# EAGLE design hb41 (EAGLE 9.6.2)
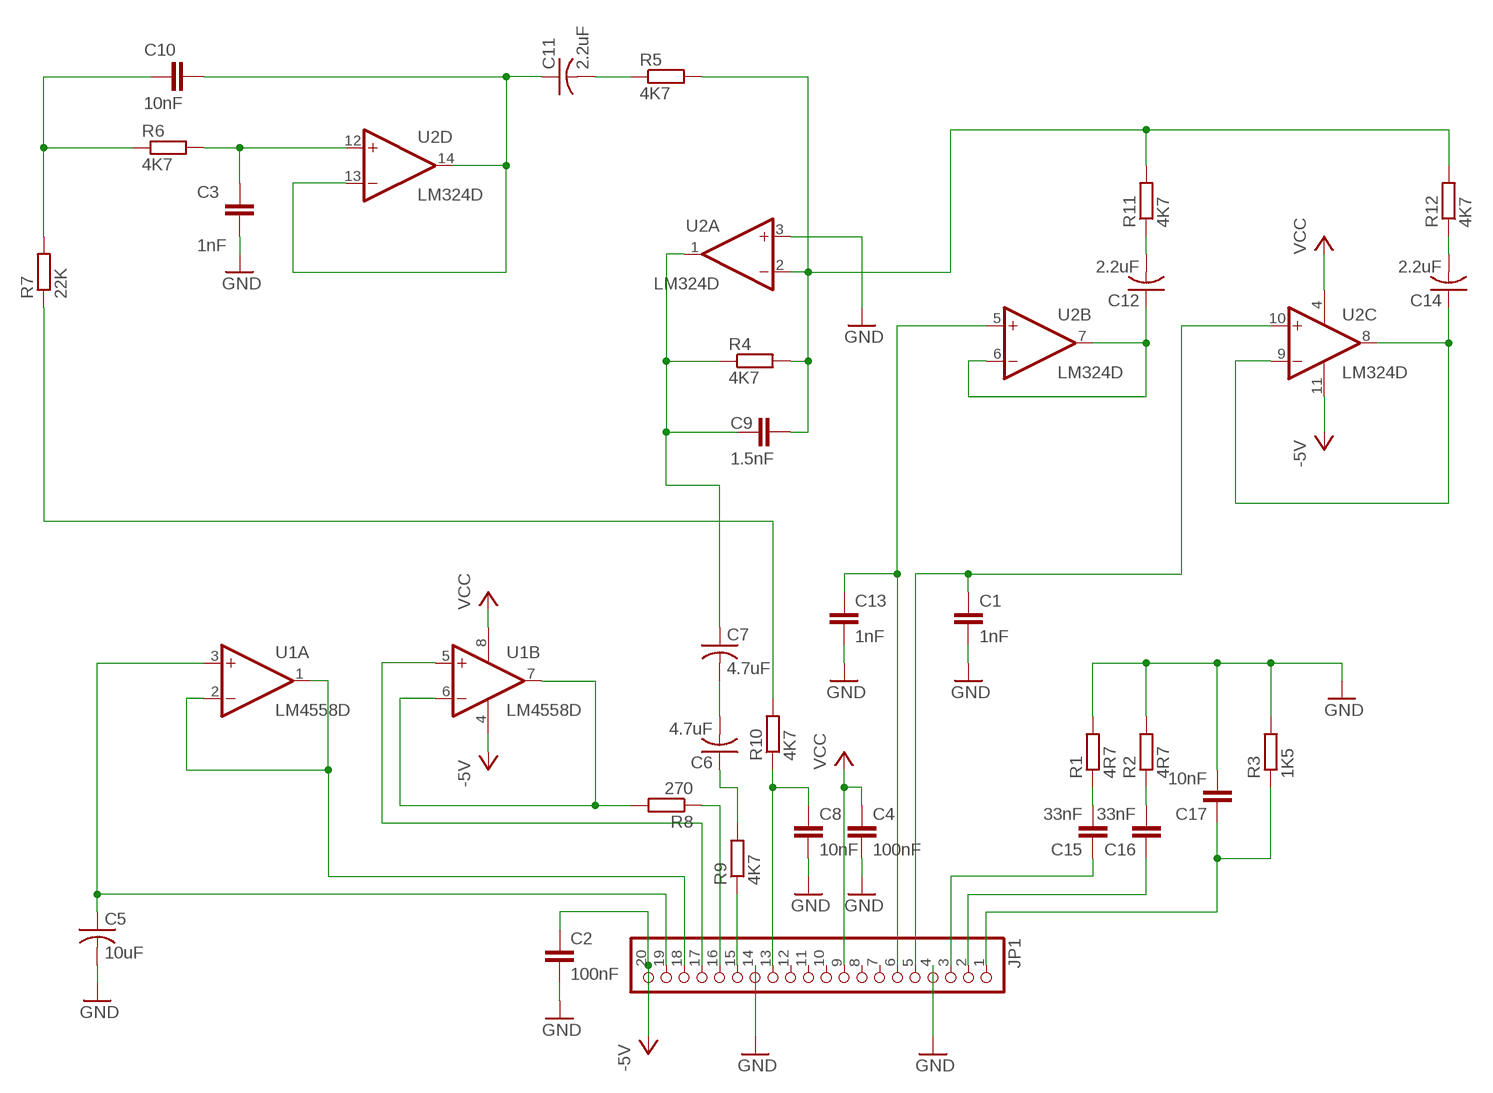
[diagram p0: schematic, sheet 1]

## Parts
C1  1nF  C-EUC0805K  [C0805K]
C2  100nF  C-EUC0805K  [C0805K]
C3  1nF  C-EUC0603  [C0603]
C4  100nF  C-EUC0603  [C0603]
C5  10uF  C-USC1206K  [C1206K]
C6  4.7uF  C-USC1206K  [C1206K]
C7  4.7uF  C-USC1206K  [C1206K]
C8  10nF  C-EUC0603  [C0603]
C9  1.5nF  C-EUC0805K  [C0805K]
C10  10nF  C-EUC0805K  [C0805K]
C11  2.2uF  C-USC1206K  [C1206K]
C12  2.2uF  C-USC1206K  [C1206K]
C13  1nF  C-EUC0805K  [C0805K]
C14  2.2uF  C-USC1206K  [C1206K]
C15  33nF  C-EUC0603  [C0603]
C16  33nF  C-EUC0603  [C0603]
C17  10nF  C-EUC0603  [C0603]
JP1  PINHD-1X20-BIG  [1X20-BIG]
R1  4R7  R-EU_R0603  [R0603]
R2  4R7  R-EU_R0603  [R0603]
R3  1K5  R-EU_R0603  [R0603]
R4  4K7  R-EU_R0603  [R0603]
R5  4K7  R-EU_R0603  [R0603]
R6  4K7  R-EU_R0603  [R0603]
R7  22K  R-EU_R0603  [R0603]
R8  270  R-EU_R0603  [R0603]
R9  4K7  R-EU_R0603  [R0603]
R10  4K7  R-EU_R0603  [R0603]
R11  4K7  R-EU_R0603  [R0603]
R12  4K7  R-EU_R0603  [R0603]
U1  LM4558D  [SO08]
U2  LM324D  [SO14]

## Nets
-5V: C2.1 JP1.20 U1.4(P:V-) U2.11(P:V-)
GND: C1.2 C2.2 C3.1 C4.2 C5.2 C8.2 C13.2 C17.2 JP1.4 JP1.14 R1.2 R2.2 R3.2 U2.3(A:+IN)
N$1: C1.1 JP1.5 U2.10(C:+IN)
N$2: C14.1 U2.8(C:OUT) U2.9(C:-IN)
N$3: C12.1 U2.6(B:-IN) U2.7(B:OUT)
N$4: C13.1 JP1.6 U2.5(B:+IN)
N$5: C15.2 R1.1
N$6: C16.2 R2.1
N$7: C17.1 JP1.1 R3.1
N$8: C12.2 R11.1
N$9: C16.1 JP1.2
N$10: C15.1 JP1.3
N$11: C14.2 R12.1
N$12: C8.1 JP1.13 R10.1
N$13: C9.2 R4.2 R5.2 R11.2 R12.2 U2.2(A:-IN)
N$14: R7.1 R10.2
N$15: C10.1 R6.1 R7.2
N$16: C3.2 R6.2 U2.12(D:+IN)
N$17: C10.2 C11.1 U2.13(D:-IN) U2.14(D:OUT)
N$18: C7.1 C9.1 R4.1 U2.1(A:OUT)
N$19: C11.2 R5.1
N$20: C6.2 C7.2
N$21: C6.1 R9.2
N$22: JP1.15 R9.1
N$23: JP1.16 R8.1
N$24: R8.2 U1.6(B:-IN) U1.7(B:OUT)
N$26: JP1.17 U1.5(B:+IN)
N$27: C5.1 JP1.19 U1.3(A:+IN)
N$28: JP1.18 U1.1(A:OUT) U1.2(A:-IN)
VCC: C4.1 JP1.9 U1.8(P:V+) U2.4(P:V+)
Unconnected: JP1.7 JP1.8 JP1.10 JP1.11 JP1.12

## Library data of the parts
C1-C4 C8-C10 C13 C15-C17 = rcl:C-EU: CAPACITOR, European symbol; SPICEPREFIX: C
C5-C7 C11 C12 C14 = rcl:C-US: CAPACITOR, American symbol; SPICEPREFIX: C
JP1 = adafruit:PINHD-1X20: PIN HEADER
R1-R12 = rcl:R-EU_: RESISTOR, European symbol; SPICEPREFIX: R
U1 = linear:*4558: OP AMP
U2 = linear:LM324: OP AMP

## Board
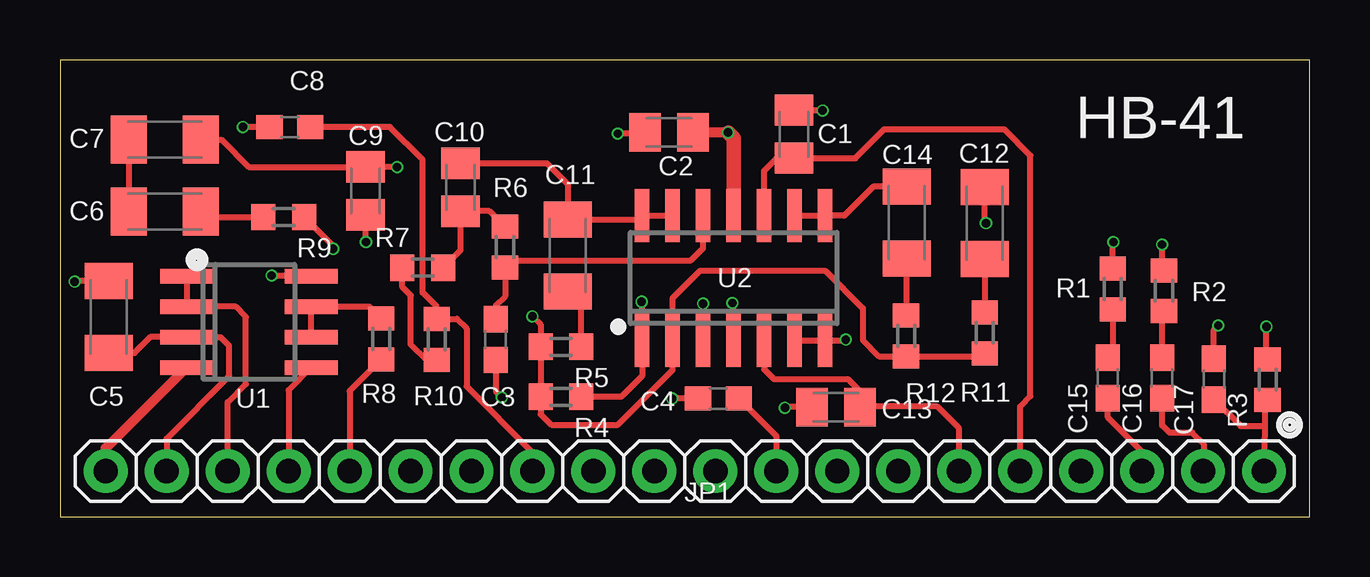
[diagram p1: board, top side]
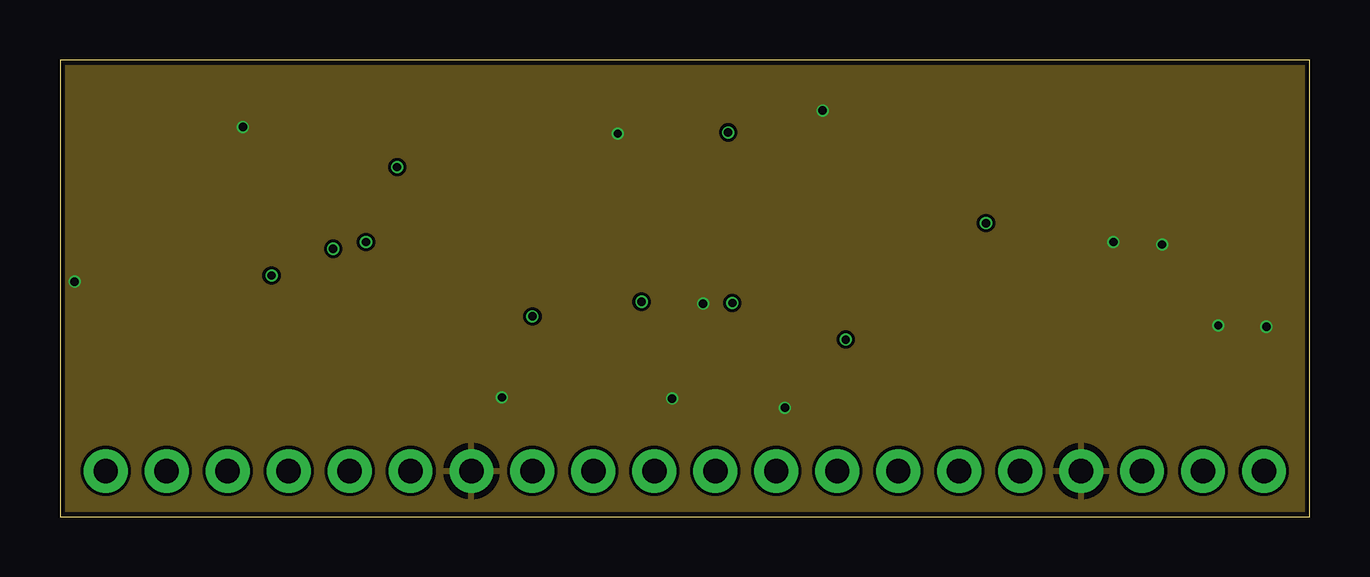
[diagram p2: board, inner layer GND]
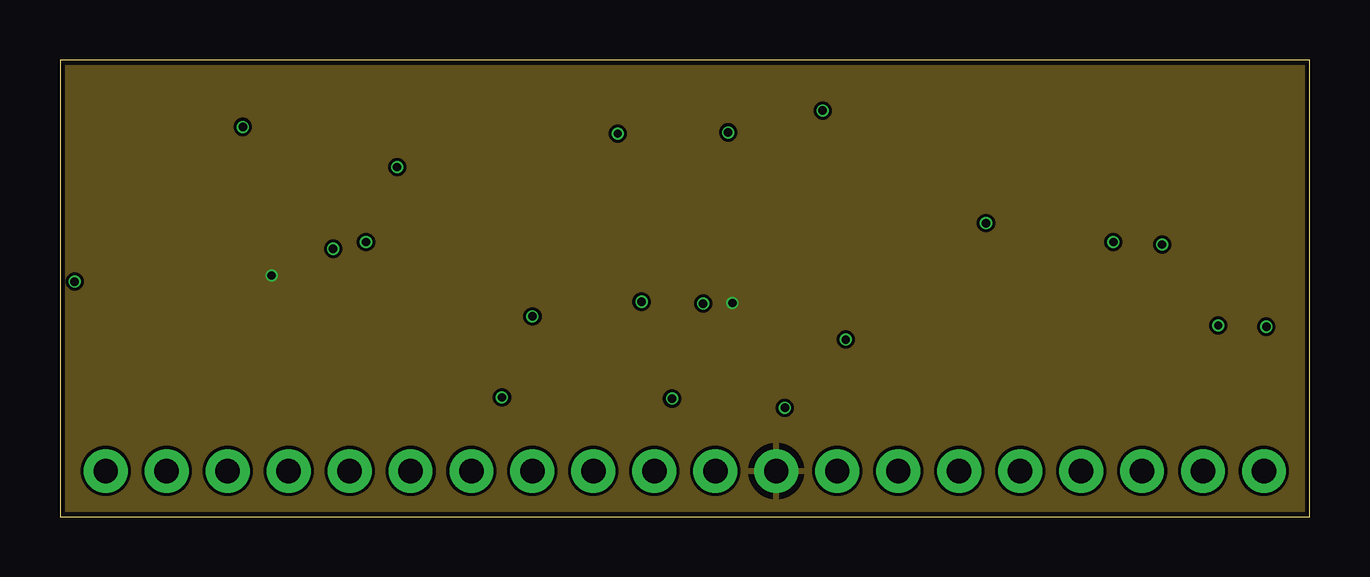
[diagram p3: board, inner layer PWR]
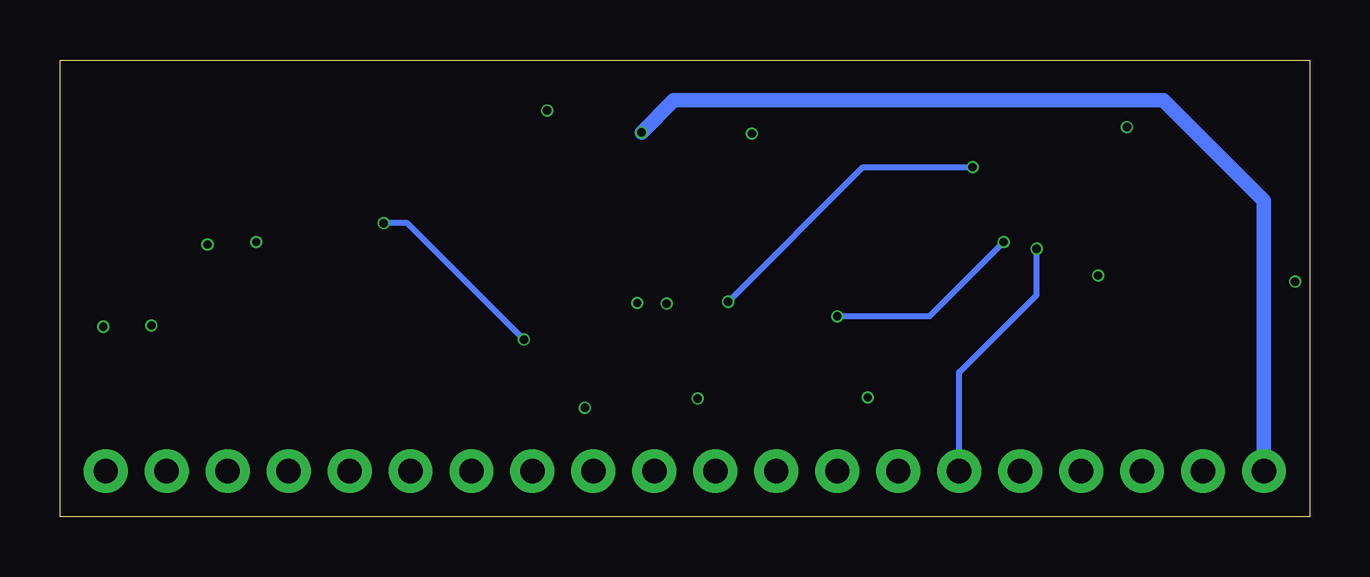
[diagram p4: board, bottom side, seen from below]

Size 52.07 x 19.05 mm. Coordinates in mm from the lower left corner, seen from the top.
Outline: 0,0 52.07,0 52.07,19.05 0,19.05 0,0
Copper layers (1*2*15*16): Top 0.035mm / dielectric 1.6mm / GND 0.035mm / dielectric 0.15mm / PWR 0.035mm / dielectric 0.2mm / Bottom 0.035mm
Design rules "jlcpcb-2layers *": minimum track width 5mil, minimum drill 0.3mm, track to track 5mil, track to pad 5mil, pad to pad 5mil, via to via 5mil, smd to smd 5mil, copper to edge 0.2mm, drill to drill 6mil, minimum pad ring 10mil, minimum via ring 3mil, stop-mask expansion 4mil, vias tented up to drill 0mil, thermal gap 10mil

### Footprints (pad centres in the part's own frame; a part is rotated, then mirrored left to right if it is on the bottom)
C0805K = smd 1.3 x 1.6: 1 -1,0; 2 1,0
C0603 = smd 1.1 x 1: 1 -0.85,0; 2 0.85,0
C1206K = smd 1.5 x 2: 1 -1.5,0; 2 1.5,0
1X20-BIG = drill 1.016 pad 1.778: 1 -24.13,0; 2 -21.59,0; 3 -19.05,0; 4 -16.51,0; 5 -13.97,0; 6 -11.43,0; 7 -8.89,0; 8 -6.35,0; 9 -3.81,0; 10 -1.27,0; 11 1.27,0; 12 3.81,0; 13 6.35,0; 14 8.89,0; 15 11.43,0; 16 13.97,0; 17 16.51,0; 18 19.05,0; 19 21.59,0; 20 24.13,0
R0603 = smd 1 x 1.1: 1 -0.85,0; 2 0.85,0
SO08 = smd 0.6 x 2.2: 1 -1.905,-2.6; 2 -0.635,-2.6; 3 0.635,-2.6; 4 1.905,-2.6; 5 1.905,2.6; 6 0.635,2.6; 7 -0.635,2.6; 8 -1.905,2.6
SO14 = smd 0.6 x 2.2: 1 -3.81,-2.6; 2 -2.54,-2.6; 3 -1.27,-2.6; 4 0,-2.6; 5 1.27,-2.6; 6 2.54,-2.6; 7 3.81,-2.6; 8 3.81,2.6; 9 2.54,2.6; 10 1.27,2.6; 11 0,2.6; 12 -1.27,2.6; 13 -2.54,2.6; 14 -3.81,2.6

### Placement (x,y rotation side)
C1  30.58,15.95 90 top
C2  25.37,16.03 180 top
C3  18.16,7.39 90 top
C4  27.43,4.93 180 top
C5  2.03,8.33 90 top
C6  4.37,12.73 180 top
C7  4.37,15.72 180 top
C8  9.58,16.26 180 top
C9  12.73,13.59 270 top
C10  16.69,13.74 90 top
C11  21.16,10.9 270 top
C12  38.53,12.24 270 top
C13  32.33,4.57 180 top
C14  35.28,12.27 270 top
C15  43.66,5.79 90 top
C16  45.92,5.79 90 top
C17  48.08,5.74 90 top
JP1  26.04,1.91 180 top
R1  43.87,9.5 90 top
R2  46,9.42 90 top
R3  50.32,5.71 90 top
R4  20.88,5 180 top
R5  20.88,7.09 180 top
R6  18.54,11.25 270 top
R7  15.11,10.39 0 top
R8  13.39,7.42 90 top
R9  9.32,12.5 180 top
R10  15.7,7.39 270 top
R11  38.53,7.67 270 top
R12  35.26,7.54 270 top
U1  7.87,8.13 270 top
U2  28.07,9.96 0 top

### Tracks (layer width: path | path; a pad name or v marks a point on that pad's centre or on a via)
-5V  (via drill 0.35)
  Top 0.254: U2.11 28.07,14.28 | 26.38,15.97 C2.1
  Top 0.406: v27.84,16.03 C2.1 | U1.4 1.91,2.85 JP1.20
  Top 0.61: U2.11 28.07,15.8 v27.84,16.03
  Bottom 0.61: JP1.20 1.91,13.18 6.1,17.37 26.49,17.37 v27.84,16.03
GND  (via drill 0.35)
  Top 0.254: R1.2 43.87,11.43 v43.89,11.46 | R2.2 45.92,10.35 v45.92,11.35 | C17.2 48.08,7.8 v48.26,7.98 | R3.2 50.27,6.62 v50.27,7.92 | C5.2 0.64,9.83 v0.61,9.8 | C8.2 v7.62,16.26 | C1.2 31.77,16.95 v31.77,16.94 | C2.2 24.32,15.98 v23.24,15.98 | U2.3 v26.8,8.89 | C13.2 30.23,4.57 v30.2,4.55 | C4.2 v25.5,4.93 | C3.1 18.16,5.23 v18.41,4.98
  pour GND: 0,19.05 0,0 52.07,0 52.07,19.05
N$1
  Top 0.254: U2.10 29.34,14.43 29.86,14.95 C1.1 33.14,14.95 34.34,16.15 39.34,16.15 40.44,15.06 40.44,5.03 40.01,4.6 JP1.5
N$2
  Top 0.254: U2.9 U2.8 32.67,12.56 33.88,13.77 C14.1
N$3  (via drill 0.35)
  Top 0.254: U2.6 U2.7 32.71,7.36 v32.74,7.39 | v38.58,12.24 38.53,12.29 C12.1
  Bottom 0.254: v32.74,7.39 37.59,12.24 v38.58,12.24
N$4
  Top 0.254: 33.33,4.6 C13.1 | JP1.6 37.47,3.68 36.55,4.6 33.33,4.6 | U2.5 29.34,6.15 29.74,5.74 32.66,5.74 32.82,5.74 33.33,5.22 33.33,4.6
N$5
  Top 0.254: C15.2 43.87,6.84 R1.1
N$6
  Top 0.254: C16.2 45.92,8.5 R2.1
N$7
  Top 0.254: R3.1 50.19,4.74 50.19,3.79 | 50.19,3.79 JP1.1 | C17.1 49.19,3.79 50.19,3.79
N$8
  Top 0.254: C12.2 R11.1
N$9
  Top 0.254: JP1.2 47.65,3.04 47.19,3.5 46.23,3.5 45.92,3.81 C16.1
N$10
  Top 0.254: C15.1 43.66,4.14 45.11,2.69 JP1.3
N$11
  Top 0.254: C14.2 35.26,10.74 R12.1
N$12
  Top 0.254: C8.1 13.74,16.26 15.11,14.88 15.11,9.35 15.7,8.76 R10.1 15.71,8.26 16.54,8.26 16.94,7.85 16.94,5.44 19.68,2.69 JP1.13
N$13  (via drill 0.35)
  Top 0.254: R11.2 38.41,6.69 R12.2 34.12,6.69 33.45,7.37 33.45,8.69 31.88,10.26 26.67,10.26 25.53,9.12 U2.2 25.53,6.12 23.24,3.83 20.47,3.83 20.03,4.28 R4.2 R5.2 20.03,8.01 v19.68,8.36 | C9.2 12.72,11.48 v12.75,11.46
  Bottom 0.254: v12.75,11.46 15.85,8.36 v19.68,8.36
N$14
  Top 0.254: R10.2 15.25,6.54 14.62,7.17 14.62,9.22 14.26,9.58 R7.1
N$15
  Top 0.254: R6.1 17.9,12.74 C10.1 16.69,11.11 R7.2
N$16
  Top 0.254: U2.12 26.8,11.2 26.29,10.69 18.83,10.69 R6.2 18.54,9.2 18.16,8.81 C3.2
N$17
  Top 0.254: C10.2 20.29,14.74 21.16,13.87 C11.1 24.1,12.4 U2.14 U2.13
N$18  (via drill 0.35)
  Top 0.254: C7.1 6.73,15.72 7.87,14.59 12.52,14.59 | 12.52,14.59 C9.1 | v24.23,8.97 24.26,8.94 U2.1 24.26,5.87 23.39,5 R4.1 | v14.05,14.58 12.53,14.58 12.52,14.59
  Bottom 0.254: v24.23,8.97 18.62,14.58 v14.05,14.58
N$19
  Top 0.254: R5.1 21.73,8.83 C11.2
N$20
  Top 0.254: C7.2 C6.2
N$21
  Top 0.254: C6.1 6.1,12.5 R9.2
N$22  (via drill 0.35)
  Top 0.254: R9.1 11.38,11.29 v11.38,11.18
  Bottom 0.254: JP1.15 14.61,6.02 11.38,9.25 v11.38,11.18
N$23
  Top 0.254: R8.1 12.06,5.25 JP1.16
N$24
  Top 0.254: R8.2 12.89,8.76 U1.7 U1.6
N$26
  Top 0.254: U1.5 9.53,5.27 JP1.17
N$27
  Top 0.254: C5.1 3.1,6.83 3.76,7.49 U1.3 6.68,7.49 7.04,7.14 7.04,5.84 4.45,3.25 JP1.19
N$28
  Top 0.254: JP1.18 6.99,4.78 7.75,5.54 7.75,8.33 7.32,8.76 U1.2 U1.1
VCC  (via drill 0.35)
  Top 0.254: U1.8 8.84,10.03 v8.81,10.06 | C4.1 29.84,3.37 JP1.9 | U2.4 28.07,8.87 v28.02,8.91
  pour PWR: 0,19.05 0,0 52.07,0 52.07,19.05

### Text on the board
tNames: HB-41